# Altium schematic sheet 17.SchDoc
size 297 x 209 mm
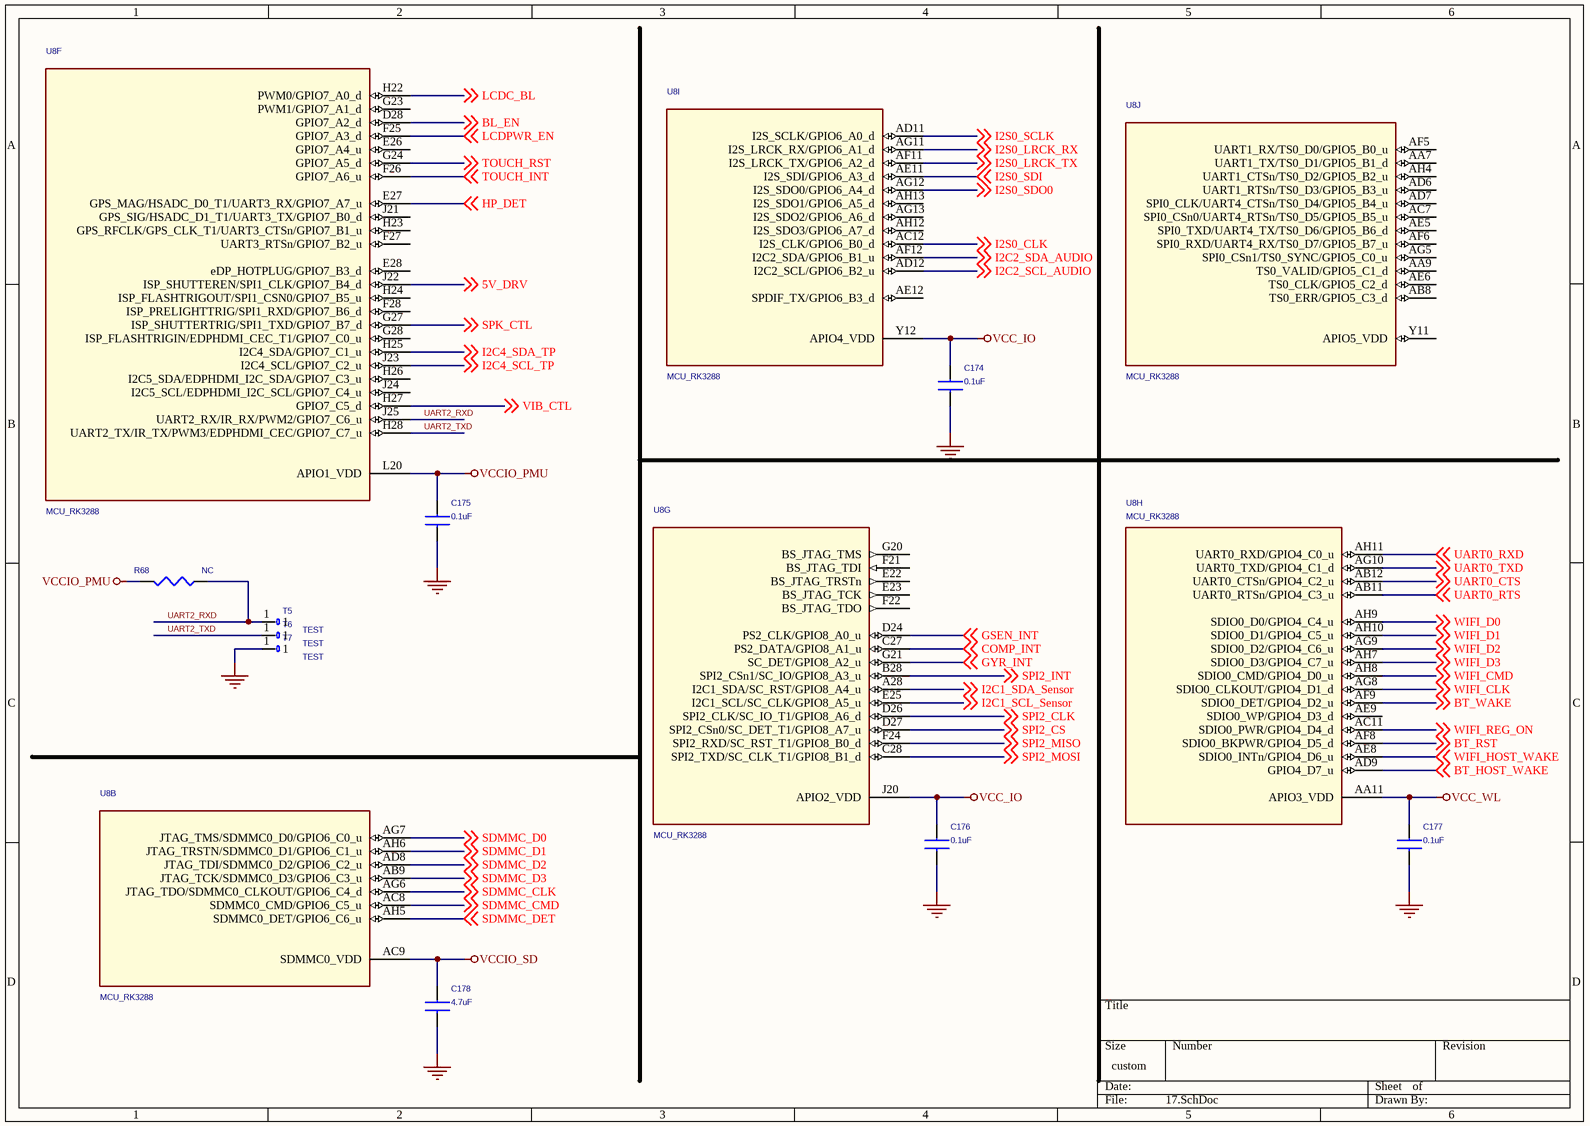
[diagram p0: 17.SchDoc]

## Parts
C174  0.1uF  [C0603]
C175  0.1uF  [C0603]
C176  0.1uF  [C0603]
C177  0.1uF  [C0603]
C178  4.7uF  [C0603]
R68  NC  [r0402]
T5  TEST  [TEST]
T6  TEST  [TEST]
T7  TEST  [TEST]
U8  MCU_RK3288  [BGA453-19X19]  (parts B,F,G,H,I,J of 24)

## Nets
GND: C174.1 C175.1 C176.2 C177.1 C178.2 T7.1
VCC_IO: C174.2 C176.1 U8.J20(APIO2_VDD) U8.Y12(APIO4_VDD)
VCC_WL: C177.2 U8.AA11(APIO3_VDD)
VCCIO_PMU: C175.2 R68.2 U8.L20(APIO1_VDD)
VCCIO_SD: C178.1 U8.AC9(SDMMC0_VDD)
5V_DRV: U8.J22(ISP_SHUTTEREN/SPI1_CLK/GPIO7_B4_d) ; off-sheet 5V_DRV
BL_EN: U8.D28(GPIO7_A2_d) ; off-sheet BL_EN
BT_HOST_WAKE: U8.AD9(GPIO4_D7_u) ; off-sheet BT_HOST_WAKE
BT_RST: U8.AF8(SDIO0_BKPWR/GPIO4_D5_d) ; off-sheet BT_RST
BT_WAKE: U8.AF9(SDIO0_DET/GPIO4_D2_u) ; off-sheet BT_WAKE
COMP_INT: U8.C27(PS2_DATA/GPIO8_A1_u) ; off-sheet COMP_INT
GSEN_INT: U8.D24(PS2_CLK/GPIO8_A0_u) ; off-sheet GSEN_INT
GYR_INT: U8.G21(SC_DET/GPIO8_A2_u) ; off-sheet GYR_INT
HP_DET: U8.E27(GPS_MAG/HSADC_D0_T1/UART3_RX/GPIO7_A7_u) ; off-sheet HP_DET
I2C1_SCL_Sensor: U8.E25(I2C1_SCL/SC_CLK/GPIO8_A5_u) ; off-sheet I2C1_SCL_Sensor
I2C1_SDA_Sensor: U8.A28(I2C1_SDA/SC_RST/GPIO8_A4_u) ; off-sheet I2C1_SDA_Sensor
I2C2_SCL_AUDIO: U8.AD12(I2C2_SCL/GPIO6_B2_u) ; off-sheet I2C2_SCL_AUDIO
I2C2_SDA_AUDIO: U8.AF12(I2C2_SDA/GPIO6_B1_u) ; off-sheet I2C2_SDA_AUDIO
I2C4_SCL_TP: U8.J23(I2C4_SCL/GPIO7_C2_u) ; off-sheet I2C4_SCL_TP
I2C4_SDA_TP: U8.H25(I2C4_SDA/GPIO7_C1_u) ; off-sheet I2C4_SDA_TP
I2S0_CLK: U8.AC12(I2S_CLK/GPIO6_B0_d) ; off-sheet I2S0_CLK
I2S0_LRCK_RX: U8.AG11(I2S_LRCK_RX/GPIO6_A1_d) ; off-sheet I2S0_LRCK_RX
I2S0_LRCK_TX: U8.AF11(I2S_LRCK_TX/GPIO6_A2_d) ; off-sheet I2S0_LRCK_TX
I2S0_SCLK: U8.AD11(I2S_SCLK/GPIO6_A0_d) ; off-sheet I2S0_SCLK
I2S0_SDI: U8.AE11(I2S_SDI/GPIO6_A3_d) ; off-sheet I2S0_SDI
I2S0_SDO0: U8.AG12(I2S_SDO0/GPIO6_A4_d) ; off-sheet I2S0_SDO0
LCDC_BL: U8.H22(PWM0/GPIO7_A0_d) ; off-sheet LCDC_BL
LCDPWR_EN: U8.F25(GPIO7_A3_d) ; off-sheet LCDPWR_EN
SDMMC_CLK: U8.AG6(JTAG_TDO/SDMMC0_CLKOUT/GPIO6_C4_d) ; off-sheet SDMMC_CLK
SDMMC_CMD: U8.AC8(SDMMC0_CMD/GPIO6_C5_u) ; off-sheet SDMMC_CMD
SDMMC_D0: U8.AG7(JTAG_TMS/SDMMC0_D0/GPIO6_C0_u) ; off-sheet SDMMC_D0
SDMMC_D1: U8.AH6(JTAG_TRSTN/SDMMC0_D1/GPIO6_C1_u) ; off-sheet SDMMC_D1
SDMMC_D2: U8.AD8(JTAG_TDI/SDMMC0_D2/GPIO6_C2_u) ; off-sheet SDMMC_D2
SDMMC_D3: U8.AB9(JTAG_TCK/SDMMC0_D3/GPIO6_C3_u) ; off-sheet SDMMC_D3
SDMMC_DET: U8.AH5(SDMMC0_DET/GPIO6_C6_u) ; off-sheet SDMMC_DET
SPI2_CLK: U8.D26(SPI2_CLK/SC_IO_T1/GPIO8_A6_d) ; off-sheet SPI2_CLK
SPI2_CS: U8.D27(SPI2_CSn0/SC_DET_T1/GPIO8_A7_u) ; off-sheet SPI2_CS
SPI2_INT: U8.B28(SPI2_CSn1/SC_IO/GPIO8_A3_u) ; off-sheet SPI2_INT
SPI2_MISO: U8.F24(SPI2_RXD/SC_RST_T1/GPIO8_B0_d) ; off-sheet SPI2_MISO
SPI2_MOSI: U8.C28(SPI2_TXD/SC_CLK_T1/GPIO8_B1_d) ; off-sheet SPI2_MOSI
SPK_CTL: U8.G27(ISP_SHUTTERTRIG/SPI1_TXD/GPIO7_B7_d) ; off-sheet SPK_CTL
TOUCH_INT: U8.F26(GPIO7_A6_u) ; off-sheet TOUCH_INT
TOUCH_RST: U8.G24(GPIO7_A5_d) ; off-sheet TOUCH_RST
UART0_CTS: U8.AB12(UART0_CTSn/GPIO4_C2_u) ; off-sheet UART0_CTS
UART0_RTS: U8.AB11(UART0_RTSn/GPIO4_C3_u) ; off-sheet UART0_RTS
UART0_RXD: U8.AH11(UART0_RXD/GPIO4_C0_u) ; off-sheet UART0_RXD
UART0_TXD: U8.AG10(UART0_TXD/GPIO4_C1_d) ; off-sheet UART0_TXD
UART2_RXD: R68.1 T5.1 U8.J25(UART2_RX/IR_RX/PWM2/GPIO7_C6_u)
UART2_TXD: T6.1 U8.H28(UART2_TX/IR_TX/PWM3/EDPHDMI_CEC/GPIO7_C7_u)
VIB_CTL: U8.H27(GPIO7_C5_d) ; off-sheet VIB_CTL
WIFI_CLK: U8.AG8(SDIO0_CLKOUT/GPIO4_D1_d) ; off-sheet WIFI_CLK
WIFI_CMD: U8.AH8(SDIO0_CMD/GPIO4_D0_u) ; off-sheet WIFI_CMD
WIFI_D0: U8.AH9(SDIO0_D0/GPIO4_C4_u) ; off-sheet WIFI_D0
WIFI_D1: U8.AH10(SDIO0_D1/GPIO4_C5_u) ; off-sheet WIFI_D1
WIFI_D2: U8.AG9(SDIO0_D2/GPIO4_C6_u) ; off-sheet WIFI_D2
WIFI_D3: U8.AH7(SDIO0_D3/GPIO4_C7_u) ; off-sheet WIFI_D3
WIFI_HOST_WAKE: U8.AE8(SDIO0_INTn/GPIO4_D6_u) ; off-sheet WIFI_HOST_WAKE
WIFI_REG_ON: U8.AC11(SDIO0_PWR/GPIO4_D4_d) ; off-sheet WIFI_REG_ON

Not connected (* = marked no-connect by the designer): U8 AA7(UART1_TX/TS0_D1/GPIO5_B1_d) AA9(TS0_VALID/GPIO5_C1_d) AB8(TS0_ERR/GPIO5_C3_d) AC7(SPI0_CSn0/UART4_RTSn/TS0_D5/GPIO5_B5_u) AD6(UART1_RTSn/TS0_D3/GPIO5_B3_u) AD7(SPI0_CLK/UART4_CTSn/TS0_D4/GPIO5_B4_u) AE5(SPI0_TXD/UART4_TX/TS0_D6/GPIO5_B6_d) AE6(TS0_CLK/GPIO5_C2_d) AE9(SDIO0_WP/GPIO4_D3_d) AE12(SPDIF_TX/GPIO6_B3_d) AF5(UART1_RX/TS0_D0/GPIO5_B0_u) AF6(SPI0_RXD/UART4_RX/TS0_D7/GPIO5_B7_u) AG5(SPI0_CSn1/TS0_SYNC/GPIO5_C0_u) AG13(I2S_SDO2/GPIO6_A6_d) AH4(UART1_CTSn/TS0_D2/GPIO5_B2_u) AH12(I2S_SDO3/GPIO6_A7_d) AH13(I2S_SDO1/GPIO6_A5_d) E22(BS_JTAG_TRSTn) E23(BS_JTAG_TCK) E26(GPIO7_A4_u) E28(eDP_HOTPLUG/GPIO7_B3_d) F21(BS_JTAG_TDI) F22(BS_JTAG_TDO) F27(UART3_RTSn/GPIO7_B2_u) F28(ISP_PRELIGHTTRIG/SPI1_RXD/GPIO7_B6_d) G20(BS_JTAG_TMS) G23(PWM1/GPIO7_A1_d) G28(ISP_FLASHTRIGIN/EDPHDMI_CEC_T1/GPIO7_C0_u) H23(GPS_RFCLK/GPS_CLK_T1/UART3_CTSn/GPIO7_B1_u) H24(ISP_FLASHTRIGOUT/SPI1_CSN0/GPIO7_B5_u) H26(I2C5_SDA/EDPHDMI_I2C_SDA/GPIO7_C3_u) J21(GPS_SIG/HSADC_D1_T1/UART3_TX/GPIO7_B0_d) J24(I2C5_SCL/EDPHDMI_I2C_SCL/GPIO7_C4_u) Y11(APIO5_VDD)

## Library data of the parts
C174 C175 C177 C178 = CAP NP_Dup3: CAP,MLCC,100nF,+/-10%,X7R,6.3V,SMD0402
C176 = CAP NP_Dup3
R68 = RESISTOR_0_Dup3: RES,thick film,10KOhm,+/-5%,1/16W,SMD0402
T5-T7 = TEST_0
U8 = MCU_RK3288_3